# EAGLE design Son1 (EAGLE 9.6.2)
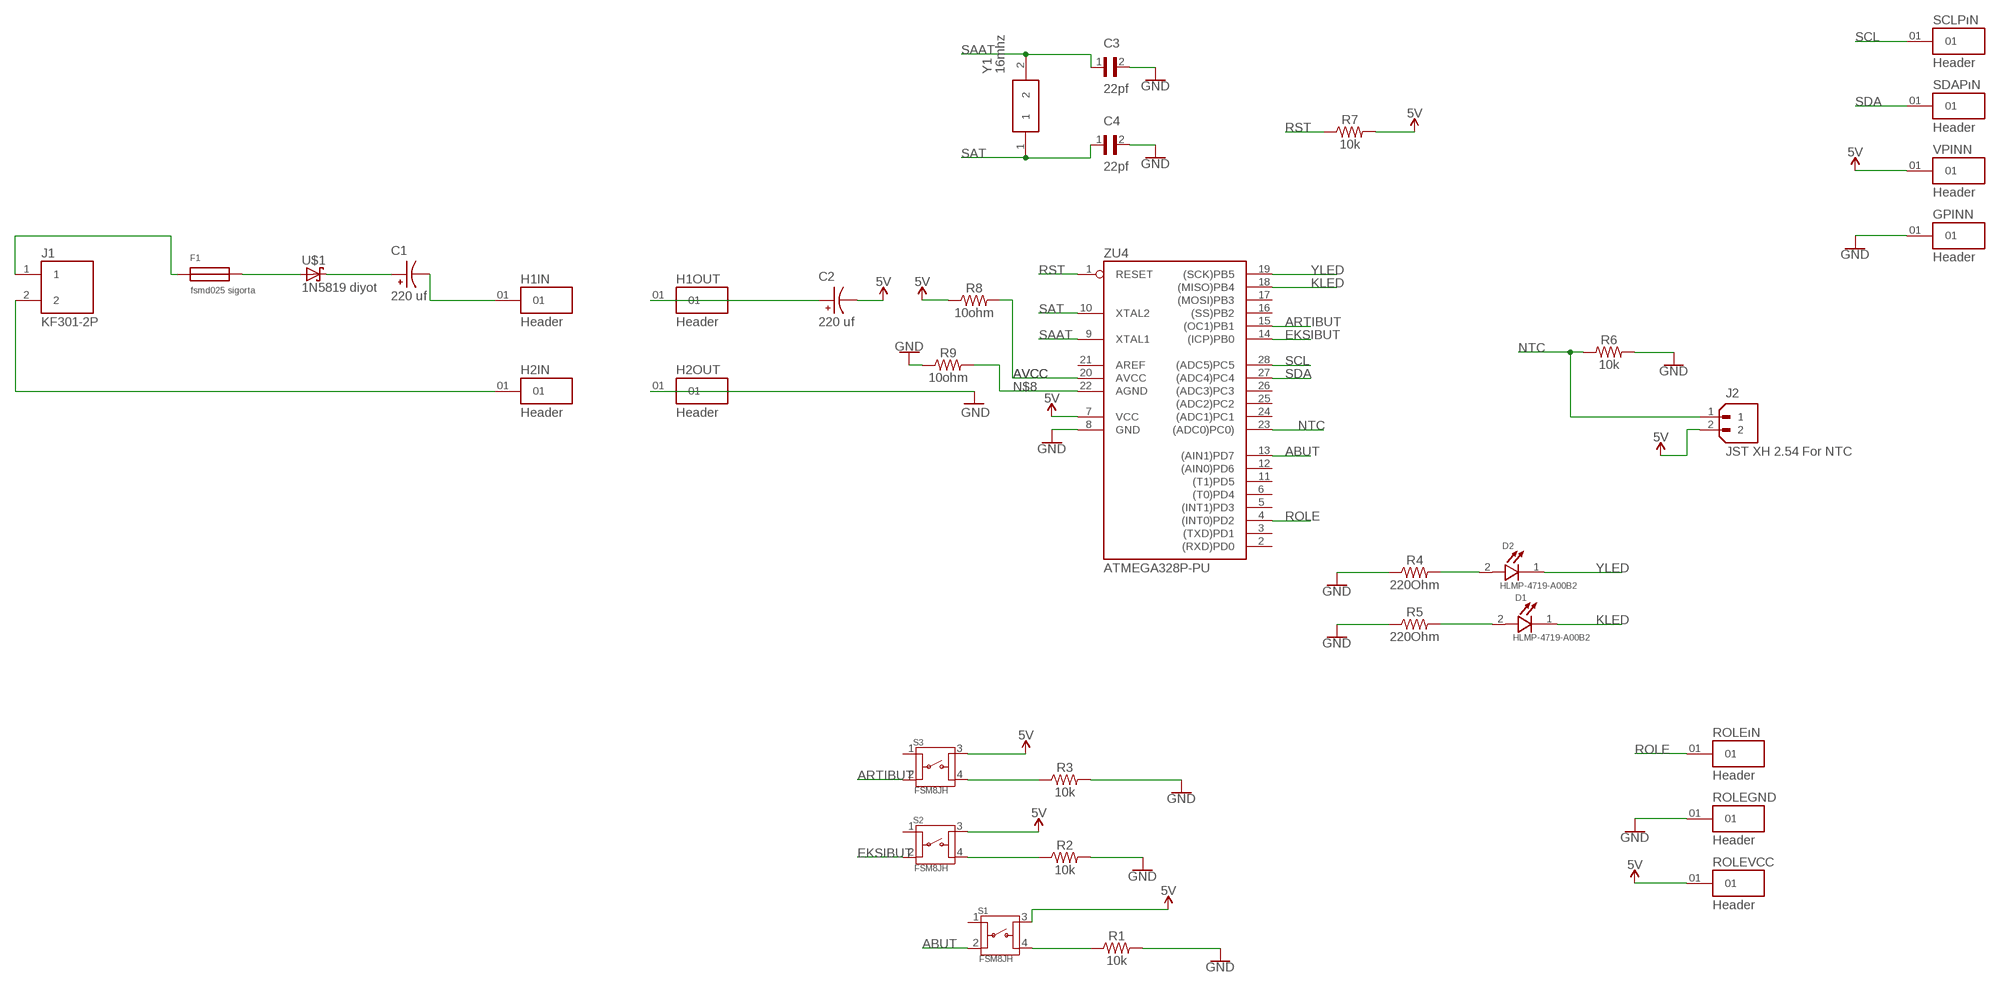
[diagram p0: schematic, sheet 1]

## Parts
C1  220 uf  EEEFP1E101AV  [CAP_EEEFP1E101AV]
C2  220 uf  EEEFP1E101AV  [CAP_EEEFP1E101AV]
C3  22pf  DE21XSA220KN3AX02F  [CAP_DE21XSA220KN3AX02F]
C4  22pf  DE21XSA220KN3AX02F  [CAP_DE21XSA220KN3AX02F]
D1  HLMP-4719-A00B2  [LEDRD254W47D584H1078]
D2  HLMP-4719-A00B2  [LEDRD254W47D584H1078]
F1  fsmd025 sigorta  0ZCN0055FF2A  [0ZCN]
GPINN  Header  MTMM-101-X-X-S-X  [SAMTEC_MTMM-101-X-X-S-X]
H1IN  Header  MTMM-101-X-X-S-X  [SAMTEC_MTMM-101-X-X-S-X]
H1OUT  Header  MTMM-101-X-X-S-X  [SAMTEC_MTMM-101-X-X-S-X]
H2IN  Header  MTMM-101-X-X-S-X  [SAMTEC_MTMM-101-X-X-S-X]
H2OUT  Header  MTMM-101-X-X-S-X  [SAMTEC_MTMM-101-X-X-S-X]
J1  KF301-2P  [HANDSON_KF301-2P]
J2  JST XH 2.54 For NTC  B2B-XH-A(LF)(SN)  [JST_B2B-XH-A(LF)(SN)]
R1  10k  10KOHM-HORIZ-1/4W-5%  [AXIAL-0.3]
R2  10k  10KOHM-HORIZ-1/4W-5%  [AXIAL-0.3]
R3  10k  10KOHM-HORIZ-1/4W-5%  [AXIAL-0.3]
R4  220Ohm  10MOHM-HORIZ-1/4W-5%  [AXIAL-0.3]
R5  220Ohm  10MOHM-HORIZ-1/4W-5%  [AXIAL-0.3]
R6  10k  10KOHM-HORIZ-1/4W-1%  [AXIAL-0.3]
R7  10k  10KOHM-HORIZ-1/4W-1%  [AXIAL-0.3]
R8  10ohm  10KOHM-HORIZ-1/4W-1%  [AXIAL-0.3]
R9  10ohm  10KOHM-HORIZ-1/4W-1%  [AXIAL-0.3]
ROLEGND  Header  MTMM-101-X-X-S-X  [SAMTEC_MTMM-101-X-X-S-X]
ROLEVCC  Header  MTMM-101-X-X-S-X  [SAMTEC_MTMM-101-X-X-S-X]
ROLEıN  Header  MTMM-101-X-X-S-X  [SAMTEC_MTMM-101-X-X-S-X]
S1  FSM8JH  [SW_FSM8JH]
S2  FSM8JH  [SW_FSM8JH]
S3  FSM8JH  [SW_FSM8JH]
SCLPıN  Header  MTMM-101-X-X-S-X  [SAMTEC_MTMM-101-X-X-S-X]
SDAPıN  Header  MTMM-101-X-X-S-X  [SAMTEC_MTMM-101-X-X-S-X]
U$1  1N5819 diyot  BAT85  [SOD68]
VPINN  Header  MTMM-101-X-X-S-X  [SAMTEC_MTMM-101-X-X-S-X]
Y1  16mhz  FOXSLF_160-20  [HC49SLF_1]
ZU4  ATMEGA328P-PU  [DIL28-3]

## Nets
5V: C2.2 J2.2 R7.P$2 R8.P$1 ROLEVCC.01 S1.3 S2.3 S3.3 VPINN.01 ZU4.7(VCC)
ABUT: S1.2 ZU4.13((AIN1)PD7)
ARTIBUT: S3.2 ZU4.15((OC1)PB1)
AVCC: R8.P$2 ZU4.20(AVCC)
EKSIBUT: S2.2 ZU4.14((ICP)PB0)
GND: C3.2 C4.2 GPINN.01 H2OUT.01 R1.P$2 R2.P$2 R3.P$2 R4.P$1 R5.P$1 R6.P$2 R9.P$1 ROLEGND.01 ZU4.8(GND)
KLED: D1.1(C) ZU4.18((MISO)PB4)
N$1: F1.P$2 U$1.A
N$2: F1.P$1 J1.1
N$3: C1.1 U$1.C(K)
N$4: C1.2 H1IN.01
N$5: H2IN.01 J1.2
N$6: C2.1 H1OUT.01
N$7: R1.P$1 S1.4
N$8: R9.P$2 ZU4.22(AGND)
N$9: R2.P$1 S2.4
N$10: R3.P$1 S3.4
N$11: D1.2(A) R5.P$2
N$12: D2.2(A) R4.P$2
NTC: J2.1 R6.P$1 ZU4.23((ADC0)PC0))
ROLE: ROLEıN.01 ZU4.4((INT0)PD2)
RST: R7.P$1 ZU4.1(RESET)
SAAT: C3.1 Y1.2 ZU4.9(XTAL1)
SAT: C4.1 Y1.1 ZU4.10(XTAL2)
SCL: SCLPıN.01 ZU4.28((ADC5)PC5)
SDA: SDAPıN.01 ZU4.27((ADC4)PC4)
YLED: D2.1(C) ZU4.19((SCK)PB5)
Unconnected: S1.1 S2.1 S3.1 ZU4.2((RXD)PD0) ZU4.3((TXD)PD1) ZU4.5((INT1)PD3) ZU4.6((T0)PD4) ZU4.11((T1)PD5) ZU4.12((AIN0)PD6) ZU4.16((SS)PB2) ZU4.17((MOSI)PB3) ZU4.21(AREF) ZU4.24((ADC1)PC1) ZU4.25((ADC2)PC2) ZU4.26((ADC3)PC3)

## Library data of the parts
C1 C2 = EEEFP1E101AV:EEEFP1E101AV: Check availability <https://pricing.snapeda.com/parts/EEEFP1E101AV/Panasonic/view-part?ref=eda>; AVAILABILITY: In Stock; CHECK_PRICES: https://www.snapeda.com/parts/EEEFP1E101AV/Panasonic/view-part/?ref=eda; DESCRIPTION: CAP ALUM 100UF 20% 25V SMD; MF: Panasonic; MP: EEEFP1E101AV; PACKAGE: RADIAL-2 Panasonic; PRICE: None; SNAPEDA_LINK: https://www.snapeda.com/parts/EEEFP1E101AV/Panasonic/view-part/?ref=snap
C3 C4 = DE21XSA220KN3AX02F:DE21XSA220KN3AX02F: Check availability <https://pricing.snapeda.com/parts/DE21XSA220KN3AX02F/Murata/view-part?ref=eda>; AVAILABILITY: In Stock; CHECK_PRICES: https://www.snapeda.com/parts/DE21XSA220KN3AX02F/Murata/view-part/?ref=eda; DESCRIPTION: Lead capacitor SL(JIS) with Capacitance 22pF, Rated Voltage 300Vac(r.m.s.); MF: Murata; MP: DE21XSA220KN3AX02F; PACKAGE: NONSTANDARD; PRICE: None; SNAPEDA_LINK: https://www.snapeda.com/parts/DE21XSA220KN3AX02F/Murata/view-part/?ref=snap
D1 D2 = HLMP-4719-A00B2:HLMP-4719-A00B2: Check availability <https://pricing.snapeda.com/parts/HLMP-4719-A00B2/Avago/view-part?ref=eda>; AVAILABILITY: Not in stock; CHECK_PRICES: https://www.snapeda.com/parts/HLMP-4719-A00B2/Avago/view-part/?ref=eda; DESCRIPTION: Yellow 5mm LED LOW CURRENT 2mA R/A T/L; MF: Avago; MP: HLMP-4719-A00B2; PACKAGE: None; PRICE: None; SNAPEDA_LINK: https://www.snapeda.com/parts/HLMP-4719-A00B2/Avago/view-part/?ref=snap
F1 = 0ZCN0055FF2A:0ZCN0055FF2A: Check availability <https://pricing.snapeda.com/parts/0ZCN0055FF2A/Bel%20Fuse%20Inc./view-part?ref=eda>; AVAILABILITY: In Stock; CHECK_PRICES: https://www.snapeda.com/parts/0ZCN0055FF2A/Bel+Circuit+Protection/view-part/?ref=eda; DESCRIPTION: Surface Mount PTC Resettable Fuse | 2016 size | 550mA | Tape & Reel; MF: Bel Fuse Inc.; MP: 0ZCN0055FF2A; PACKAGE: 2016 Bel Fuse Inc.; PRICE: None; SNAPEDA_LINK: https://www.snapeda.com/parts/0ZCN0055FF2A/Bel+Circuit+Protection/view-part/?ref=snap
GPINN H1IN H1OUT H2IN H2OUT ROLEGND ROLEVCC ROLEıN SCLPıN SDAPıN VPINN = MTMM-101-X-X-S-X:MTMM-101-X-X-S-X: Check availability <https://pricing.snapeda.com/parts/MTMM-101-03-T-S-120/Samtec/view-part?ref=eda>; AVAILABILITY: In Stock; CHECK_PRICES: https://www.snapeda.com/parts/MTMM-101-03-T-S-120/Samtec/view-part/?ref=eda; DESCRIPTION: Connector Header Through Hole 1 position; MF: Samtec; MP: MTMM-101-03-T-S-120; PACKAGE: None; PRICE: None; SNAPEDA_LINK: https://www.snapeda.com/parts/MTMM-101-03-T-S-120/Samtec/view-part/?ref=snap
J1 = KF301-2P:KF301-2P: Check availability <https://pricing.snapeda.com/parts/KF301-2P/Handson%20Technology/view-part?ref=eda>; AVAILABILITY: Not in stock; CHECK_PRICES: https://www.snapeda.com/parts/KF301-2P/Handson+Technology/view-part/?ref=eda; DESCRIPTION: 2 Pin Terminal Block 5mm Pitch; MF: Handson Technology; MP: KF301-2P; PACKAGE: None; PRICE: None; SNAPEDA_LINK: https://www.snapeda.com/parts/KF301-2P/Handson+Technology/view-part/?ref=snap
J2 = B2B-XH-A_LF__SN_:B2B-XH-A(LF)(SN): Check availability <https://pricing.snapeda.com/parts/B2B-XH-A%28LF%29%28SN%29/JST%20Sales%20America%20Inc./view-part?ref=eda>; AVAILABILITY: In Stock; CHECK_PRICES: https://www.snapeda.com/parts/B2B-XH-A(LF)(SN)/JST/view-part/?ref=eda; DESCRIPTION: Connector Header Through Hole 2 position 0.098 (2.50mm); MF: JST Sales America Inc.; MP: B2B-XH-A(LF)(SN); PACKAGE: None; PRICE: None; SNAPEDA_LINK: https://www.snapeda.com/parts/B2B-XH-A(LF)(SN)/JST/view-part/?ref=snap
R1-R3 = SparkFun-Resistors:10KOHM: 10kΩ resistor A resistor is a passive two-terminal electrical component that implements electrical resistance as a circuit element. Resistors act to reduce current flow, and, at the same time, act to lower voltage levels within circuits. - Wikipedia; PROD_ID: RES-09435
R4 R5 = SparkFun-Resistors:10MOHM: RES-09327; PROD_ID: RES-09327; VALUE: 10M
R6 R7 = SparkFun-Resistors:10KOHM: 10kΩ resistor A resistor is a passive two-terminal electrical component that implements electrical resistance as a circuit element. Resistors act to reduce current flow, and, at the same time, act to lower voltage levels within circuits. - Wikipedia; PROD_ID: RES-12183
R8 R9 = SparkFun-Resistors:10KOHM: 10kΩ resistor A resistor is a passive two-terminal electrical component that implements electrical resistance as a circuit element. Resistors act to reduce current flow, and, at the same time, act to lower voltage levels within circuits. - Wikipedia; PROD_ID: RES-12183; VALUE: 10k
S1-S3 = FSM8JH:FSM8JH: Check availability <https://pricing.snapeda.com/parts/FSM8JH/TE%20Connectivity/view-part?ref=eda>; AVAILABILITY: In Stock; CHECK_PRICES: https://www.snapeda.com/parts/FSM8JH/TE+Connectivity+ALCOSWITCH+Switches/view-part/?ref=eda; DESCRIPTION: Switch,Pushbutton,Tactile,SPST,Thru Hole,Vertical,6MM,Black | TE Connectivity FSM8JH; MF: TE Connectivity; MP: FSM8JH; PACKAGE: None; PRICE: None; SNAPEDA_LINK: https://www.snapeda.com/parts/FSM8JH/TE+Connectivity+ALCOSWITCH+Switches/view-part/?ref=snap
U$1 = BAT85:BAT85: Check availability <https://pricing.snapeda.com/parts/BAT85/EIC%20Semiconductor/view-part?ref=eda>; AVAILABILITY: Not in stock; CHECK_PRICES: https://www.snapeda.com/parts/BAT85/EIC+Semiconductor/view-part/?ref=eda; DESCRIPTION: DIODE ARRAY SCHOTTKY 40V SOT323; MF: EIC Semiconductor; MP: BAT85; PACKAGE: SOT-323 EIC Semiconductor; PRICE: None; SNAPEDA_LINK: https://www.snapeda.com/parts/BAT85/EIC+Semiconductor/view-part/?ref=snap
Y1 = FOXSLF_160-20:FOXSLF_160-20: Check availability <https://pricing.snapeda.com/parts/FOXSLF/160-20/Fox%20Electronics/view-part?ref=eda>; AVAILABILITY: In Stock; CHECK_PRICES: https://www.snapeda.com/parts/FOXSLF/160-20/Fox+Electronics/view-part/?ref=eda; DESCRIPTION: Oscillator, Crystal,16MHz,HC-49S,TH,+/-30ppm,-20 to +70ppm,40 Ohms,Fund.,20pF | Fox Electronics FOXSLF/160-20; MF: Fox Electronics; MP: FOXSLF/160-20; PACKAGE: HC-49/US Fox Electronics; PRICE: None; SNAPEDA_LINK: https://www.snapeda.com/parts/FOXSLF/160-20/Fox+Electronics/view-part/?ref=snap
ZU4 = SmartPrj:ATMEGA328P-: MICROCONTROLLER 4 Kbytes FLASH 128 bytes SRAM 256 bytes EEPROM UART 6-channel 10 bit ADC

## Board
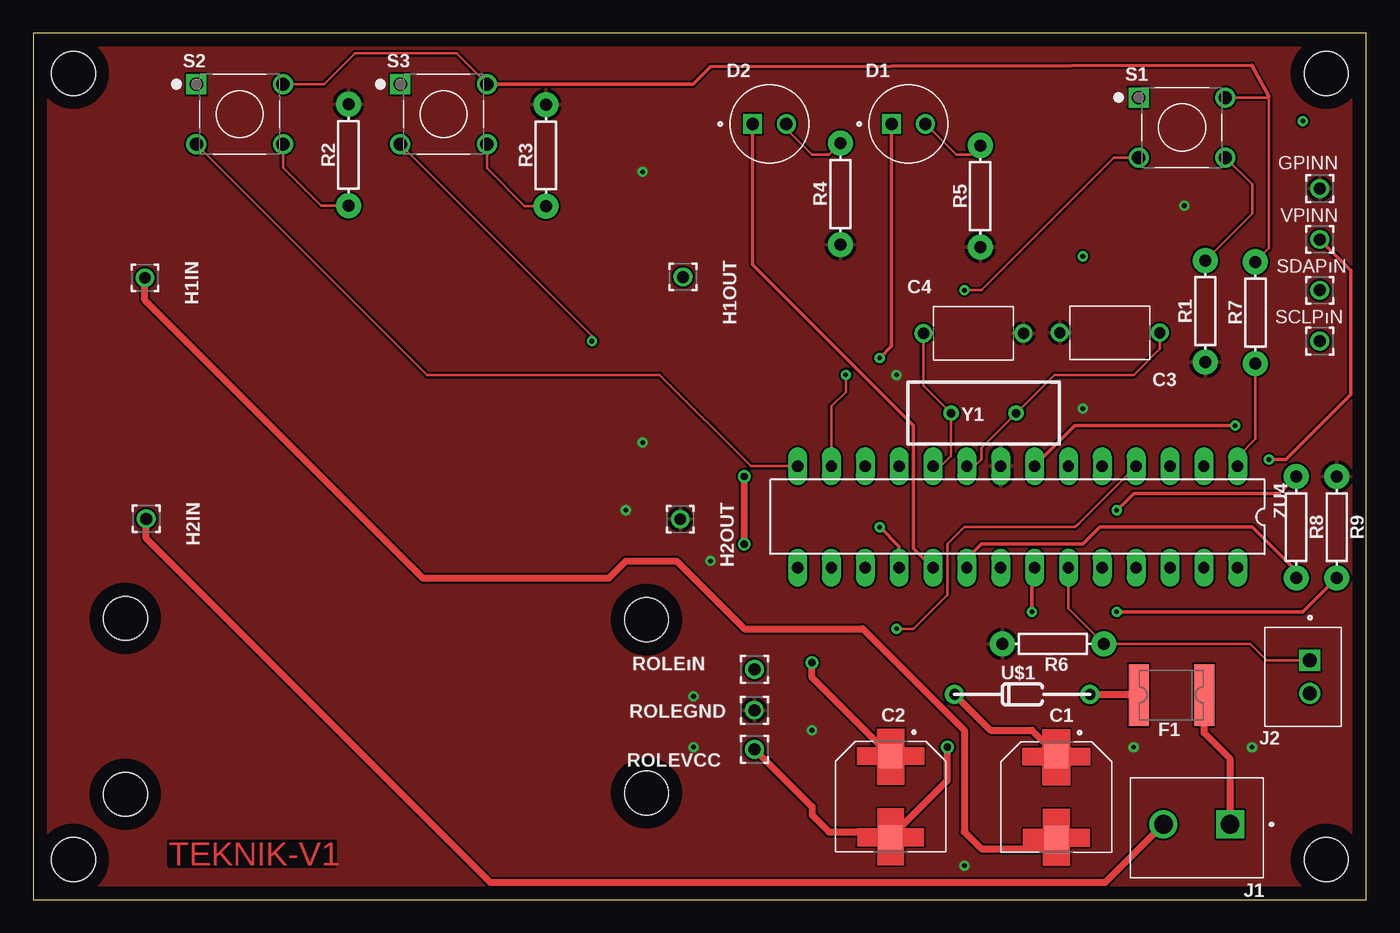
[diagram p1: board, top side]
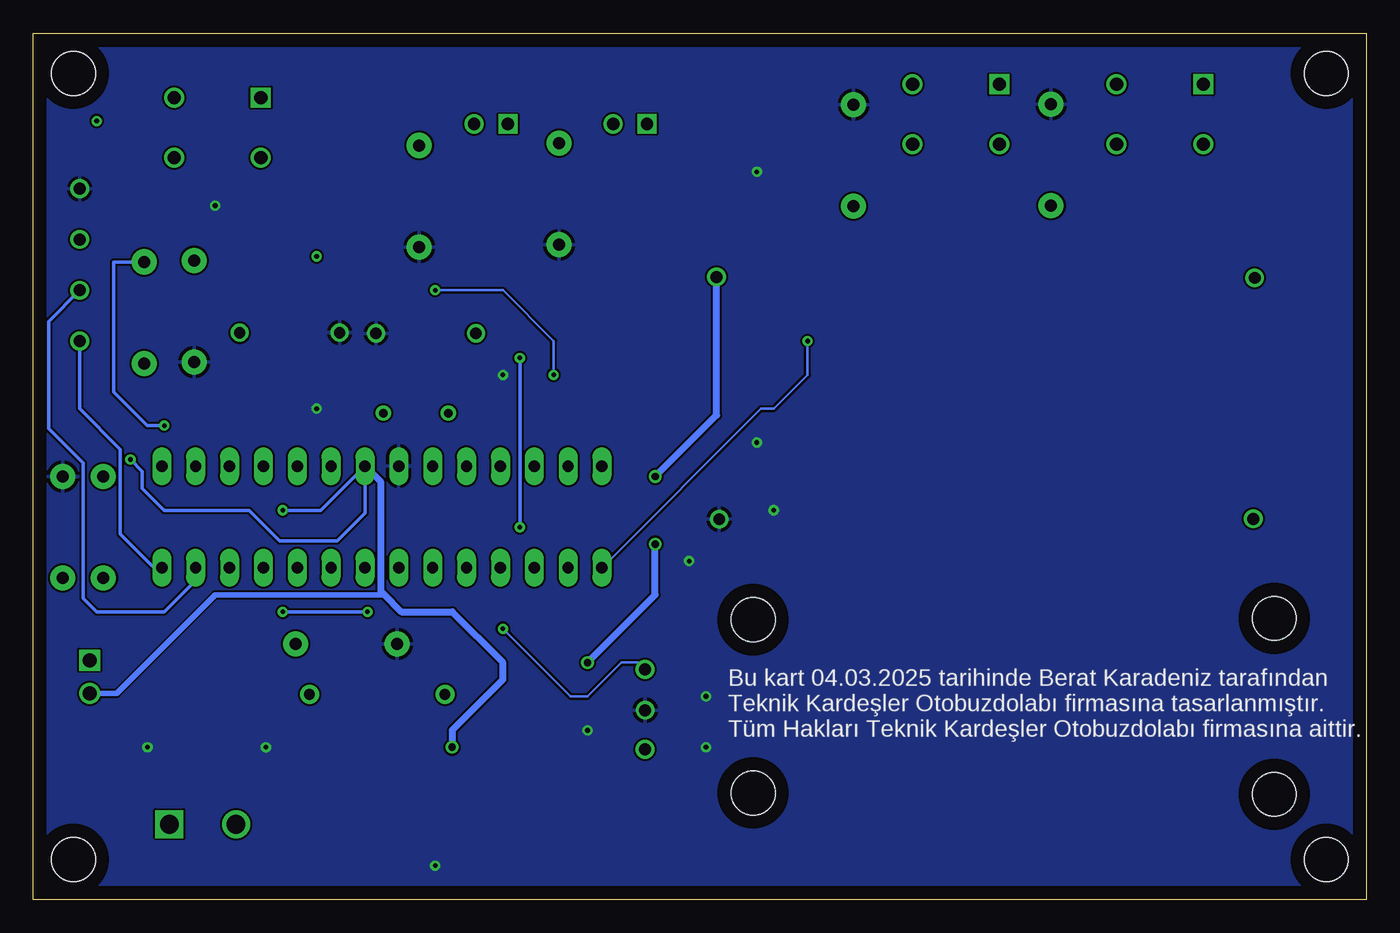
[diagram p2: board, bottom side, seen from below]

Size 100 x 65 mm. Coordinates in mm from the lower left corner, seen from the top.
Outline: 0,0 100,0 100,65 0,65 0,0
Copper layers (1*16): Top 0.035mm / dielectric 1.5mm / Bottom 0.035mm
Design rules "default": minimum track width 6mil, minimum drill 0.35mm, track to track 6mil, track to pad 6mil, pad to pad 6mil, via to via 6mil, smd to smd 6mil, copper to edge 40mil, drill to drill 6mil, minimum pad ring 10mil, minimum via ring 8mil, stop-mask expansion 4mil, vias tented up to drill 0mil, thermal gap 10mil
Holes 3.3 mm at 6.9,21.1 6.9,7.9 46,21 46,8 3,62 3,3 97,62 97,3

### Footprints (pad centres in the part's own frame; a part is rotated, then mirrored left to right if it is on the bottom)
CAP_EEEFP1E101AV = smd 1.8 x 1.8: 1 -3.05,0; 2 3.05,0
CAP_DE21XSA220KN3AX02F = drill 0.85 pad 1.28: 1 -3.75,0; 2 3.75,0
LEDRD254W47D584H1078 = drill 0.93 square: 1 -1.27,0 | drill 0.93: 2 1.27,0
0ZCN = smd 1.5 x 4.6: P$1 -2.45,0; P$2 2.45,0
SAMTEC_MTMM-101-X-X-S-X = drill 0.89 pad 1.24: 01 0,0
HANDSON_KF301-2P = drill 1.4 square: 1 -2.5,0 | drill 1.4: 2 2.5,0
JST_B2B-XH-A(LF)(SN) = drill 1.05 square: 1 1.25,-0.525 | drill 1.05: 2 -1.25,-0.525
AXIAL-0.3 = drill 0.9 pad 1.88: P$1 -3.81,0; P$2 3.81,0
SW_FSM8JH = drill 0.99 square: 1 -3.25,2.25 | drill 0.99: 2 -3.25,-2.25; 3 3.25,2.25; 4 3.25,-2.25
SOD68 = drill 0.8 pad 1.422: A -5.08,0; C 5.08,0
HC49SLF_1 = drill 0.63 pad 1.13: 1 -2.44,0; 2 2.44,0
DIL28-3 = drill 0.85 pad 1.422 long: 1 -16.51,-3.81; 2 -13.97,-3.81; 3 -11.43,-3.81; 4 -8.89,-3.81; 5 -6.35,-3.81; 6 -3.81,-3.81; 7 -1.27,-3.81; 8 1.27,-3.81; 9 3.81,-3.81; 10 6.35,-3.81; 11 8.89,-3.81; 12 11.43,-3.81; 13 13.97,-3.81; 14 16.51,-3.81; 15 16.51,3.81; 16 13.97,3.81; 17 11.43,3.81; 18 8.89,3.81; 19 6.35,3.81; 20 3.81,3.81; 21 1.27,3.81; 22 -1.27,3.81; 23 -3.81,3.81; 24 -6.35,3.81; 25 -8.89,3.81; 26 -11.43,3.81; 27 -13.97,3.81; 28 -16.51,3.81

### Placement (x,y rotation side)
C1  76.75,7.68 270 top
C2  64.32,7.72 270 top
C3  80.77,42.53 180 top
C4  70.54,42.48 0 top
D1  65.66,58.2 0 top
D2  55.23,58.2 0 top
F1  85.39,15.35 180 top
GPINN  96.52,53.34 90 top
H1IN  8.37,46.65 270 top
H1OUT  48.74,46.72 270 top
H2IN  8.47,28.57 270 top
H2OUT  48.54,28.54 270 top
J1  87.29,5.65 180 top
J2  95.25,16.71 90 top
R1  87.93,44.15 270 top
R2  23.64,55.87 90 top
R3  38.46,55.84 90 top
R4  60.55,52.94 90 top
R5  71.04,52.78 90 top
R6  76.5,19.18 180 top
R7  91.69,44.04 90 top
R8  94.74,27.94 270 top
R9  97.79,27.94 270 top
ROLEGND  54.1,14.2 90 top
ROLEVCC  54.11,11.27 90 top
ROLEıN  54.11,17.27 90 top
S1  86.18,57.93 0 top
S2  15.48,58.93 0 top
S3  30.78,58.93 0 top
SCLPıN  96.52,41.91 90 top
SDAPıN  96.52,45.72 90 top
U$1  74.2,15.4 180 top
VPINN  96.52,49.53 90 top
Y1  71.3,36.5 0 top
ZU4  73.85,28.71 180 top

### Tracks (layer width: path | path; a pad name or v marks a point on that pad's centre or on a via)
5V  (via drill 0.35, 0.55)
  Top 0.203: 92.71,60.28 92.71,60.18 | 92.71,60.18 92.71,48.87 R7.P$2 | 92.71,60.18 S1.3 | S2.3 21.81,61.18 24.13,63.5 31.75,63.5 34.03,61.22 S3.3
  Top 0.254: ZU4.7 78.16,35.56 v90.17,35.56 | S3.3 49.5,61.18 50.8,62.48 91.43,62.61 92.71,60.28 | R8.P$1 93.47,30.48 82.55,30.48 v81.28,29.21 | VPINN.01 98.3,47.75 98.81,47.24 98.86,47.24 98.86,37.9 93.98,33.02 v92.71,33.02
  Top 0.508: ROLEVCC.01 58.42,6.96 58.42,6.35 59.69,5.08 63.91,5.08 C2.2 68.58,8.93 v68.58,11.43
  Bottom 0.254: R7.P$2 93.98,47.85 93.98,38.1 91.44,35.56 v90.17,35.56 | v81.28,29.21 78.43,29.21 ZU4.7 75.12,29.02 77.22,26.92 81.53,26.92 83.82,29.21 90.17,29.21 91.82,30.86 91.82,32.13 v92.71,33.02
  Bottom 0.406: 73.66,22.86 86.36,22.86 93.76,15.46 J2.2
  Bottom 0.508: ZU4.7 73.91,31.31 73.91,23.11 73.66,22.86 72.39,21.59 68.58,21.59 64.77,17.78 64.77,16.51 68.58,12.7 v68.58,11.43
ABUT  (via drill 0.35)
  Top 0.203: ZU4.13 59.88,37.02 60.96,38.1 v60.96,39.37 | v69.85,45.72 71.12,45.72 81.08,55.68 S1.2
  Bottom 0.203: v60.96,39.37 60.96,41.91 64.77,45.72 v69.85,45.72
ARTIBUT  (via drill 0.35)
  Top 0.203: S3.2 41.91,42.3 v41.91,41.91
  Bottom 0.203: v41.91,41.91 41.91,39.37 44.45,36.83 45.41,36.83 ZU4.15
AVCC
  Top 0.254: R8.P$2 94.74,24.64 91.44,27.94 80.01,27.94 78.74,26.67 71.12,26.67 70.04,25.59 ZU4.20
EKSIBUT
  Top 0.203: S2.2 29.54,39.37 46.99,39.37 53.84,32.52 ZU4.14
GND  (via drill 0.35)
  other vias: 69.85,2.54 49.53,15.24 49.53,11.43 58.42,12.7 78.74,36.83 64.77,39.37 82.55,11.43 91.44,11.43 86.36,52.07 45.72,54.61 44.45,29.21 50.8,25.4 45.72,34.29
  pour Top: -5,67 -5,-5 104,-5 104,-4 104,67
  pour Bottom: -3,67 -3,-5 104,-5 104,-3 104,68 -3,68
KLED  (via drill 0.35)
  Top 0.254: D1.1 64.39,41.53 v63.5,40.64 | v63.5,27.94 64.96,26.48 ZU4.18
  Bottom 0.254: v63.5,40.64 v63.5,27.94
N$1
  Top 0.508: F1.P$2 79.33,15.35 U$1.A
N$2
  Top 0.508: J1.1 89.79,10.54 87.84,12.49 F1.P$1
N$3
  Top 0.508: U$1.C 71.82,12.7 74.93,12.7 76.75,10.88 C1.1
N$4
  Top 0.508: C1.2 76.75,3.81 71.12,3.81 69.85,5.08 69.85,12.7 62.23,20.32 53.34,20.32 48.26,25.4 44.45,25.4 43.18,24.13 29.21,24.13 8.37,44.97 H1IN.01
N$5
  Top 0.508: J1.2 80.41,1.27 34.29,1.27 8.47,27.09 H2IN.01
N$6  (via drill 0.55)
  Top 0.508: C2.1 58.42,16.67 v58.42,17.78 | v53.34,26.67 v53.34,31.75
  Bottom 0.508: v58.42,17.78 53.34,22.86 v53.34,26.67 | v53.34,31.75 48.74,36.35 H1OUT.01
N$7
  Top 0.203: R1.P$1 91.44,51.47 91.44,53.67 S1.4
N$8  (via drill 0.35)
  Top 0.254: R9.P$2 95.25,21.59 v81.28,21.59 | v74.93,21.59 74.93,24.71 ZU4.22
  Bottom 0.254: v81.28,21.59 v74.93,21.59
N$9
  Top 0.203: R2.P$1 21.6,52.06 18.73,54.93 S2.4
N$10
  Top 0.203: R3.P$1 36.87,52.03 34.03,54.87 S3.4
N$11
  Top 0.203: R5.P$2 70.34,55.88 69.25,55.88 D1.2
N$12
  Top 0.203: R4.P$2 59.68,55.88 58.42,55.88 56.5,57.8 D2.2
N$13  (via drill 0.35)
  other vias: 95.25,58.42
N$14  (via drill 0.35)
  other vias: 78.74,48.26
NTC
  Top 0.203: J2.1 92.53,17.96 91.31,19.18 R6.P$1 77.66,21.83 ZU4.23
ROLE  (via drill 0.35)
  Top 0.203: ZU4.4 78.45,28.23 78.16,27.94 69.85,27.94 68.58,26.67 68.58,22.86 66.04,20.32 v64.77,20.32
  Bottom 0.203: v64.77,20.32 59.69,15.24 58.42,15.24 55.88,17.78 54.62,17.78 ROLEıN.01
RST
  Top 0.203: ZU4.1 90.36,33.21 91.69,34.54 R7.P$1
SAAT
  Top 0.203: ZU4.9 70.62,32.52 71.12,33.02 71.12,33.88 Y1.2 76.61,39.37 82.55,39.37 84.52,41.34 C3.1
SAT
  Top 0.203: ZU4.10 68.08,32.52 68.86,33.3 Y1.1 66.79,38.57 C4.1
SCL
  Bottom 0.254: SCLPıN.01 96.52,36.83 93.47,33.78 93.47,27.43 90.94,24.9 ZU4.28
SDA
  Bottom 0.254: SDAPıN.01 98.86,43.38 98.86,35.36 96.27,32.77 96.27,22.61 95.25,21.59 90.17,21.59 87.82,23.94 ZU4.27
YLED
  Top 0.254: D2.1 53.96,47.64 66.04,35.56 66.04,26.36 ZU4.19

### Text on the board
Top: TEKNIK-V1
bPlace: Bu kart 04.03.2025 tarihinde Berat Karadeniz tarafından / Teknik Kardeşler Otobuzdolabı firmasına tasarlanmıştır. / Tüm Hakları Teknik Kardeşler Otobuzdolabı firmasına aittir.
tStop: TEKNIK-V1